# Altium schematic sheet amigaDIP48_2025-07-20.schdoc
size 463 x 260 mm
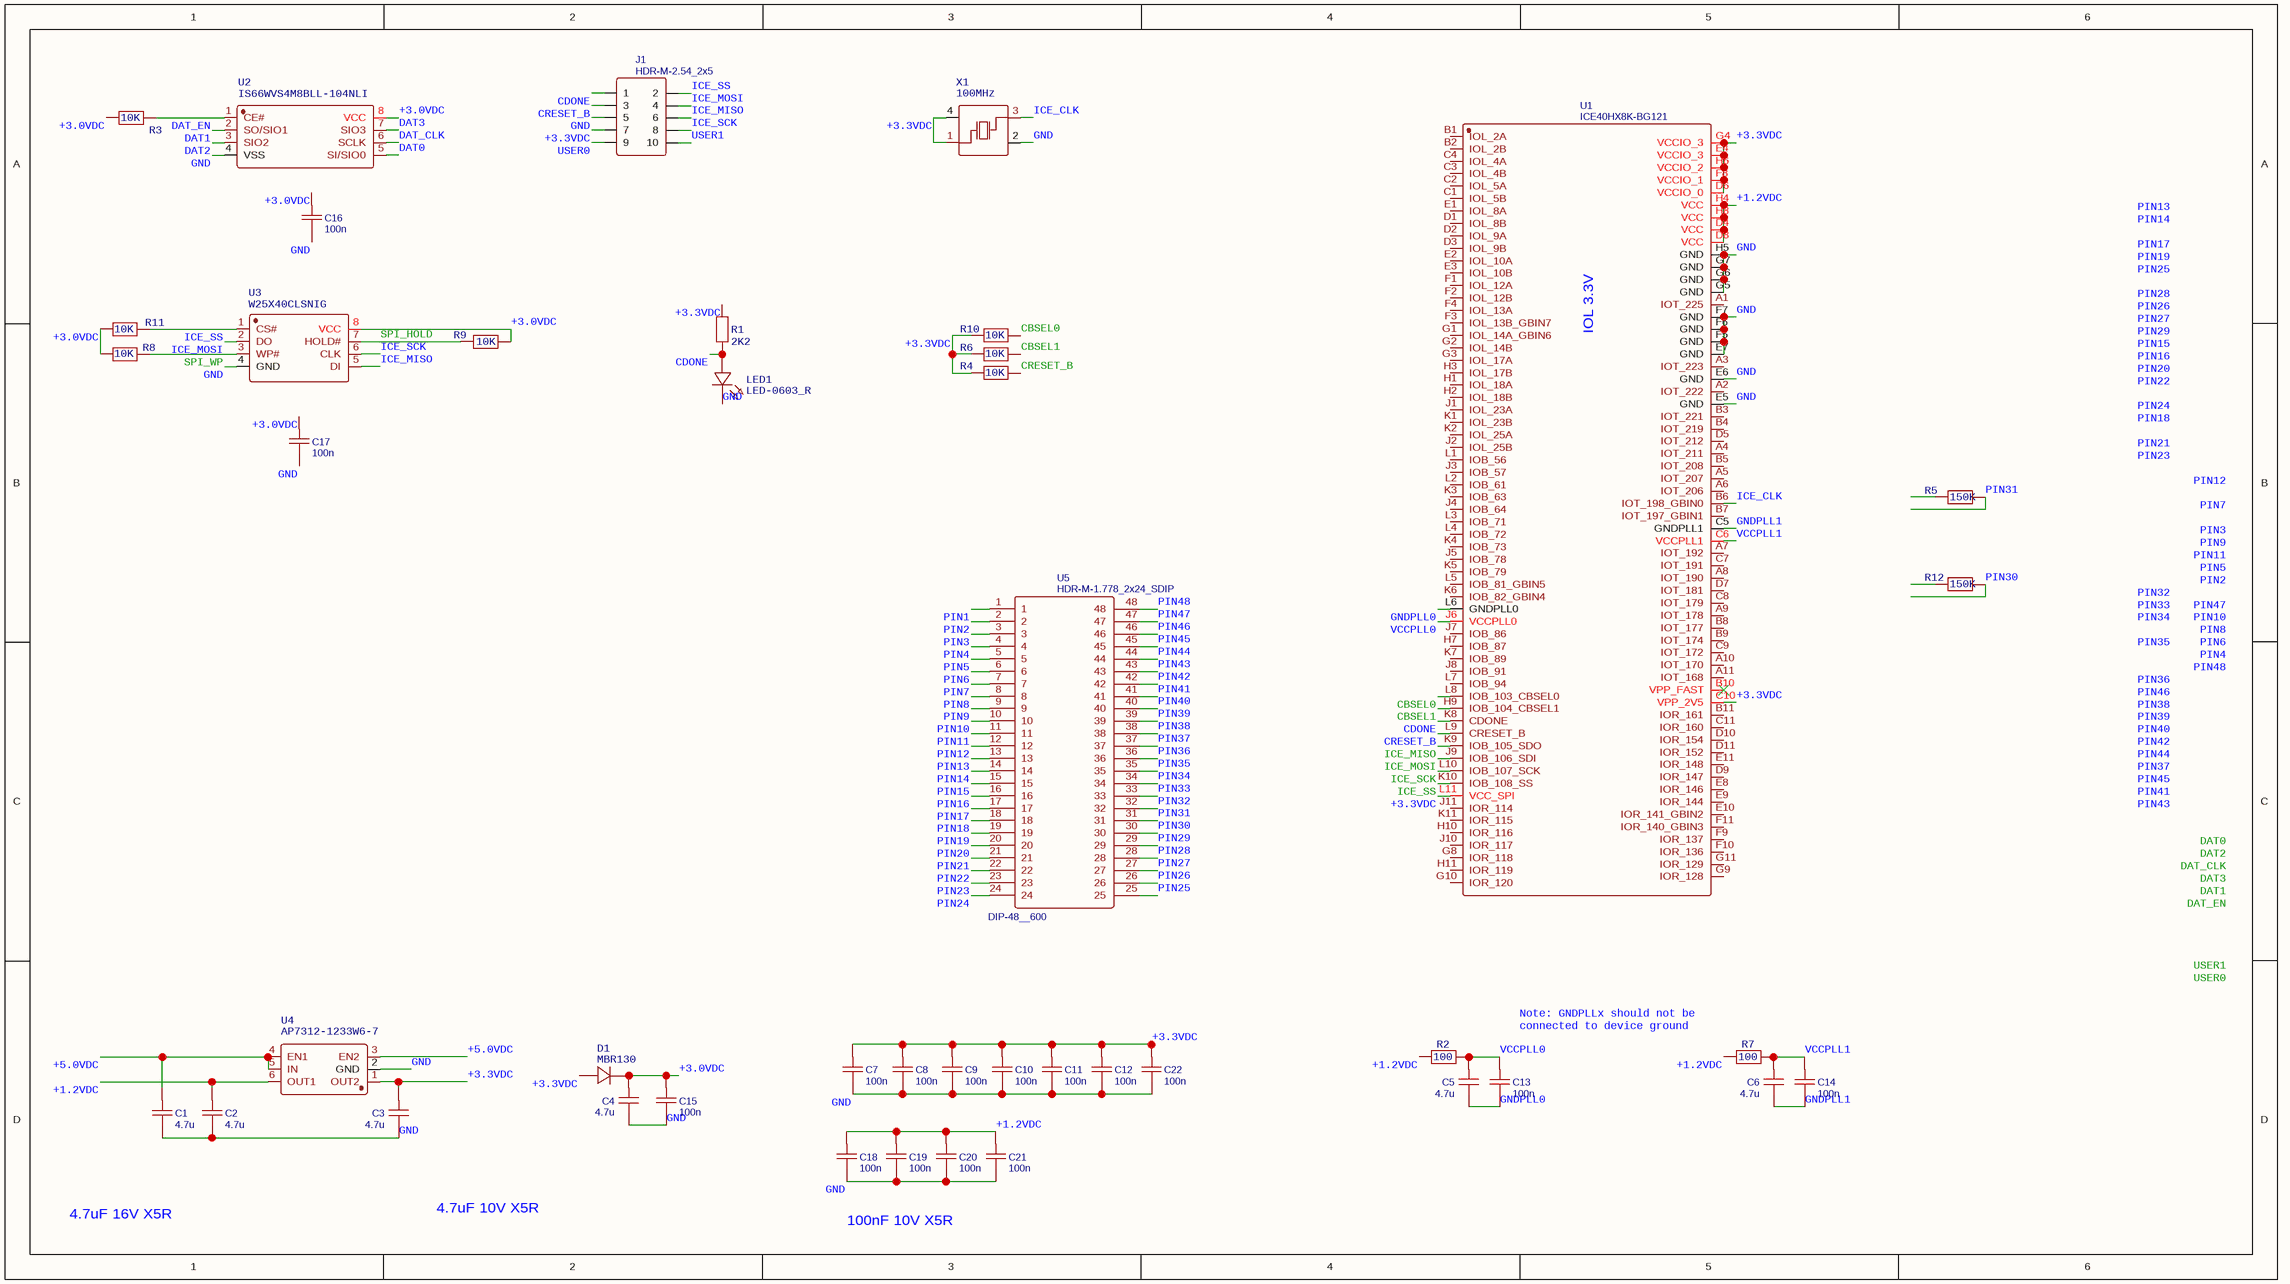
[diagram p0: amigaDIP48_2025-07-20.schdoc]

## Parts
C1  4.7u  [C0603]
C2  4.7u  [C0402]
C3  4.7u  [C0402]
C4  4.7u  [C0402]
C5  4.7u  [C0402]
C6  4.7u  [C0402]
C7  100n  [C0402]
C8  100n  [C0402]
C9  100n  [C0402]
C10  100n  [C0402]
C11  100n  [C0402]
C12  100n  [C0402]
C13  100n  [C0402]
C14  100n  [C0402]
C15  100n  [C0402]
C16  100n  [C0402]
C17  100n  [C0402]
C18  100n  [C0402]
C19  100n  [C0402]
C20  100n  [C0402]
C21  100n  [C0402]
C22  100n  [C0402]
D1  MBR130  [SOD-123_L2.8-W1.8-LS3.7-RD]
J1  HDR-M-2.54_2x5  [HDR-M-2.54_2X5]
LED1  LED-0603_R  [LED0603_RED]
R1  2K2  [R0603]
R2  100  [R0402]
R3  10K  [R0402]
R4  10K  [R0402]
R5  150K  [R0402]
R6  10K  [R0402]
R7  100  [R0402]
R8  10K  [R0402]
R9  10K  [R0402]
R10  10K  [R0402]
R11  10K  [R0402]
R12  150K  [R0402]
U1  ICE40HX8K-BG121  [CABGA-121_L9.0-W9.0-R11-C11-P0.80-TL]
U2  IS66WVS4M8BLL-104NLI  [SOIC-8_L4.9-W3.9-P1.27-LS6.1-BL]
U3  W25X40CLSNIG  [SOIC-8_L4.9-W3.9-P1.27-LS6.1-BL]
U4  AP7312-1233W6-7  [SOT-26_L3.0-W1.6-P0.95-LS2.8-BR]
U5  HDR-M-1.778_2x24_SDIP  [DIP-48__600]
X1  100MHz  [OSC-SMD_4P-L3.2-W2.5-BL]

## Nets
+1.2VDC: C2.2 C18.2 C19.2 C20.2 C21.2 R2.1 R7.1 U1.D4(VCC) U1.D8(VCC) U1.H4(VCC) U1.H8(VCC) U4.6(OUT1)
+3.0VDC: C4.2 C15.2 C16.2 C17.2 D1.1(C) R3.1 R8.1 R9.1 R11.1 U2.8(VCC) U3.8(VCC)
+3.3VDC: C3.2 C7.2 C8.2 C9.2 C10.2 C11.2 C12.2 C22.2 D1.2(A) J1.7 R1.2 R4.1 R6.1 R10.1 U1.C10(VPP_2V5) U1.D6(VCCIO_0) U1.E4(VCCIO_3) U1.F8(VCCIO_1) U1.G4(VCCIO_3) U1.H6(VCCIO_2) U1.L11(VCC_SPI) U4.1(OUT2) X1.1(OSC1) X1.4(GND)
+5.0VDC: C1.2 U4.3(EN2) U4.4(EN1) U4.5(IN)
CBSEL0: R10.2 U1.L8(IOB_103_CBSEL0)
CBSEL1: R6.2 U1.H9(IOB_104_CBSEL1)
CDONE: J1.1 LED1.1 R1.1 U1.K8(CDONE)
CRESET_B: J1.3 R4.2 U1.L9(CRESET_B)
DAT0: U2.5(SI/SIO0)
DAT1: U2.2(SO/SIO1)
DAT2: U2.3(SIO2)
DAT3: U2.7(SIO3)
DAT_CLK: U2.6(SCLK)
DAT_EN: R3.2 U2.1(CE#)
GND: C1.1 C2.1 C3.1 C4.1 C7.1 C8.1 C9.1 C10.1 C11.1 C12.1 C15.1 C16.1 C17.1 C18.1 C19.1 C20.1 C21.1 C22.1 J1.5 LED1.2 U1.E5(GND) U1.E6(GND) U1.E7(GND) U1.F5(GND) U1.F6(GND) U1.F7(GND) U1.G5(GND) U1.G6(GND) U1.G7(GND) U1.H5(GND) U2.4(VSS) U3.4(GND) U4.2(GND) X1.2(GND)
GNDPLL0: C5.1 C13.1 U1.L6(GNDPLL0)
GNDPLL1: C6.1 C14.1 U1.C5(GNDPLL1)
ICE_CLK: U1.B6(IOT_198_GBIN0) X1.3(OSC2)
ICE_MISO: J1.6 U1.K9(IOB_105_SDO) U3.5(DI)
ICE_MOSI: J1.4 U1.J9(IOB_106_SDI) U3.2(DO)
ICE_SCK: J1.8 U1.L10(IOB_107_SCK) U3.6(CLK)
ICE_SS: J1.2 R11.2 U1.K10(IOB_108_SS) U3.1(CS#)
PIN1: U5.1
PIN2: U5.2
PIN3: U5.3
PIN4: U5.4
PIN5: U5.5
PIN6: U5.6
PIN7: U5.7
PIN8: U5.8
PIN9: U5.9
PIN10: U5.10
PIN11: U5.11
PIN12: U5.12
PIN13: U5.13
PIN14: U5.14
PIN15: U5.15
PIN16: U5.16
PIN17: U5.17
PIN18: U5.18
PIN19: U5.19
PIN20: U5.20
PIN21: U5.21
PIN22: U5.22
PIN23: U5.23
PIN24: U5.24
PIN25: U5.25
PIN26: U5.26
PIN27: U5.27
PIN28: U5.28
PIN29: U5.29
PIN30: R12.2 U5.30
PIN31: R5.2 U5.31
PIN32: U5.32
PIN33: U5.33
PIN34: U5.34
PIN35: U5.35
PIN36: U5.36
PIN37: U5.37
PIN38: U5.38
PIN39: U5.39
PIN40: U5.40
PIN41: U5.41
PIN42: U5.42
PIN43: U5.43
PIN44: U5.44
PIN45: U5.45
PIN46: U5.46
PIN47: U5.47
PIN48: U5.48
SPI_HOLD: R9.2 U3.7(HOLD#)
SPI_WP: R8.2 U3.3(WP#)
USER0: J1.9
USER1: J1.10
VCCPLL0: C5.2 C13.2 R2.2 U1.J6(VCCPLL0)
VCCPLL1: C6.2 C14.2 R7.2 U1.C6(VCCPLL1)

Not connected (* = marked no-connect by the designer): R5 1; R12 1; U1 A1(IOT_225) A2(IOT_222) A3(IOT_223) A4(IOT_211) A5(IOT_207) A6(IOT_206) A7(IOT_192) A8(IOT_190) A9(IOT_178) A10(IOT_170) A11(IOT_168) B1(IOL_2A) B2(IOL_2B) B3(IOT_221) B4(IOT_219) B5(IOT_208) B7(IOT_197_GBIN1) B8(IOT_177) B9(IOT_174) B10(VPP_FAST)* B11(IOR_161) C1(IOL_5B) C2(IOL_5A) C3(IOL_4B) C4(IOL_4A) C7(IOT_191) C8(IOT_179) C9(IOT_172) C11(IOR_160) D1(IOL_8B) D2(IOL_9A) D3(IOL_9B) D5(IOT_212) D7(IOT_181) D9(IOR_147) D10(IOR_154) D11(IOR_152) E1(IOL_8A) E2(IOL_10A) E3(IOL_10B) E8(IOR_146) E9(IOR_144) E10(IOR_141_GBIN2) E11(IOR_148) F1(IOL_12A) F2(IOL_12B) F3(IOL_13B_GBIN7) F4(IOL_13A) F9(IOR_137) F10(IOR_136) F11(IOR_140_GBIN3) G1(IOL_14A_GBIN6) G2(IOL_14B) G3(IOL_17A) G8(IOR_118) G9(IOR_128) G10(IOR_120) G11(IOR_129) H1(IOL_18A) H2(IOL_18B) H3(IOL_17B) H7(IOB_87) H10(IOR_116) H11(IOR_119) J1(IOL_23A) J2(IOL_25B) J3(IOB_57) J4(IOB_64) J5(IOB_78) J7(IOB_86) J8(IOB_91) J10(IOR_117) J11(IOR_114) K1(IOL_23B) K2(IOL_25A) K3(IOB_63) K4(IOB_73) K5(IOB_79) K6(IOB_82_GBIN4) K7(IOB_89) K11(IOR_115) L1(IOB_56) L2(IOB_61) L3(IOB_71) L4(IOB_72) L5(IOB_81_GBIN5) L7(IOB_94)

## Notes on the sheet
- (near U1) IOL 3.3V
- (near C13) Note: GNDPLLx should not be
  connected to device ground
- 4.7uF 16V X5R
- 4.7uF 10V X5R
- 100nF 10V X5R
- Labels drawn without touching a wire or pin: DAT0, DAT1, DAT2, DAT3, DAT_CLK, DAT_EN, PIN2, PIN3, PIN4, PIN5, PIN6, PIN7, PIN8, PIN9, PIN10, PIN11, PIN12, PIN13, PIN14, PIN15, PIN16, PIN17, PIN18, PIN19, PIN20, PIN21, PIN22, PIN23, PIN24, PIN25, PIN26, PIN27, PIN28, PIN29, PIN32, PIN33, PIN34, PIN35, PIN36, PIN37, PIN38, PIN39, PIN40, PIN41, PIN42, PIN43, PIN44, PIN45, PIN46, PIN47, PIN48, USER0, USER1
- (in symbol HDR-M-1.778_2x24_SDIP) DIP-48__600

## Library data of the parts
C1-C6 = 4.7u: Manufacturer: SAMSUNG(三星); Manufacturer Part: CL05A475KP5NRNC; nameAlias: Capacitance; Contributor: LCSC; Supplier: LCSC; Supplier Part: C368809; JLCPCB Part Class: Extended Part; spicePre: C; spiceSymbolName: CL05A475KP5NRNC
C7-C22 = 100n: Manufacturer: SAMSUNG(三星); Manufacturer Part: CL03A104KP3NNNC; nameAlias: Capacitance; Supplier: LCSC; Supplier Part: C49062; JLCPCB Part Class: Extended Part; spicePre: C; spiceSymbolName: CL03A104KP3NNNC
D1 = MBR130: Manufacturer: SK; Contributor: LCSC; Supplier: LCSC; Manufacturer Part: MBR130; Supplier Part: C126484; JLCPCB Part Class: Extended Part; spicePre: D; spiceSymbolName: MBR130
J1 = HDR-M-2.54_2x5: Contributor: LCEDA_Lib; Supplier Part: C178292; Supplier: LCSC; spicePre: J; spiceSymbolName: HDR-M-2.54_2x5
LED1 = LED-0603_R: Manufacturer: EVERLIGHT(台湾亿光); Manufacturer Part: 19-217/R6C-AL1M2VY/3T; Contributor: LCEDA_01; Supplier Part: C72044; Supplier: LCSC; spicePre: L; spiceSymbolName: LED-0603_R
R1 = 2K2: Manufacturer Part: 0402WGF1003TCE; Manufacturer: UniOhm; nameAlias: Value(Ω); Contributor: LCEDA_Lib; Supplier Part: C25741; Supplier: LCSC; spicePre: R; spiceSymbolName: R_0201_EU
R2 R7 = 100: Manufacturer Part: CR0201J100KQ15Z; Manufacturer: EVER OHMS(天二科技); nameAlias: Value(Ω); Contributor: LCEDA_Lib; Supplier Part: C881195; Supplier: LCSC; spicePre: R; spiceSymbolName: R_0201_EU
R3 R4 R6 R8-R11 = 10K: Manufacturer Part: CR0201F10K0Q15Z; Manufacturer: EVER OHMS(天二科技); nameAlias: Value(Ω); Contributor: LCEDA_Lib; Supplier Part: C881217; Supplier: LCSC; spicePre: R; spiceSymbolName: R_0201_EU
R5 R12 = 150K: Manufacturer Part: WR02X154JAL; Manufacturer: Walsin(华新科); nameAlias: Value(Ω); Contributor: LCEDA_Lib; Supplier Part: C384428; Supplier: LCSC; spicePre: R; spiceSymbolName: R_0201_EU
U1 = ICE40HX8K-BG121: Manufacturer: LATTICE(莱迪思); Contributor: LCSC; Supplier: LCSC; Supplier Part: C1521843; Manufacturer Part: ICE40HX8K-BG121; JLCPCB Part Class: Extended Part; spicePre: U; spiceSymbolName: ICE40HX8K-BG121
U2 = IS66WVS4M8BLL-104NLI: Manufacturer: null; Manufacturer Part: ESP-PSRAM64H; Contributor: LCSC; Supplier: LCSC; Supplier Part: C2763896; JLCPCB Part Class: Extended Part; spicePre: U; spiceSymbolName: ESP-PSRAM64H
U3 = W25X40CLSNIG: Manufacturer: WINBOND; Supplier: LCSC; Manufacturer Part: W25X40CLSNIG; Supplier Part: C19617; JLCPCB Part Class: Extended Part; spicePre: U; spiceSymbolName: W25X40CLSNIG
U4 = AP7312-1233W6-7: Manufacturer: DIODES(美台); Manufacturer Part: AP7312-1828W6-7; Contributor: lcsc; Supplier: LCSC; Supplier Part: C5125494; link: https://atta.szlcsc.com/upload/public/pdf/source/20220805/60E9168373D2E630B0C5B82E73D8D7A9.pdf; spicePre: U; spiceSymbolName: AP7312-1828W6-7
U5 = HDR-M-1.778_2x24_SDIP: Contributor: Renee; Package Display: Yes; spicePre: U; spiceSymbolName: HDR-M-1.778_2x24_SDIP
X1 = 100MHz: Manufacturer: TAITIEN Elec; Manufacturer Part: OXETDLJTNF-100.000000MHZ; nameAlias: Frequency; Contributor: LCSC; Supplier: LCSC; Supplier Part: C558770; spicePre: X; spiceSymbolName: SMD-3225_4P12MHZ10PF10PPM-40~+85℃